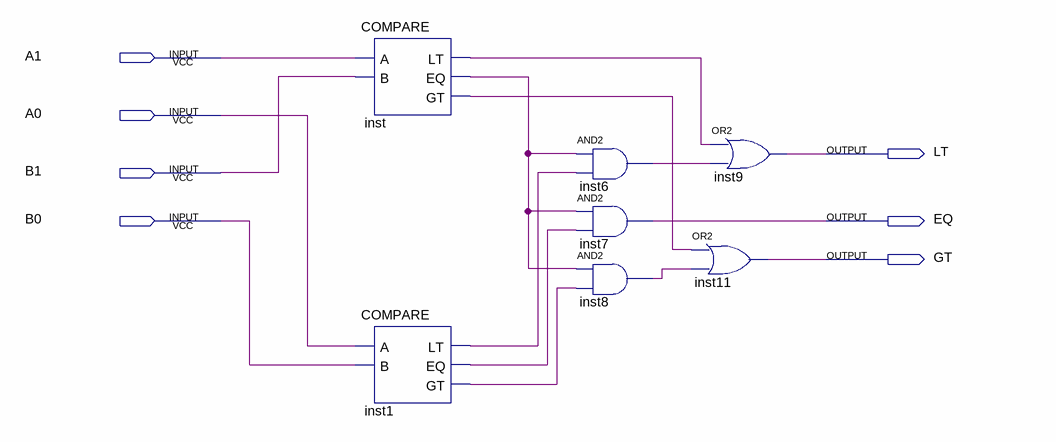
[diagram p0: schematic sheet]
// Quartus schematic COMPARE_2Bit.bdf as structural Verilog: 7 symbols, 7 pins
module COMPARE_2Bit (
  input  A1,
  input  A0,
  input  B1,
  input  B0,
  output LT,
  output EQ,
  output GT
);

  wire inst1_eq, inst1_gt, inst1_lt, inst6_out, inst8_out, inst_eq, inst_gt, inst_lt;

  COMPARE inst (.A(A1), .B(B1), .LT(inst_lt), .EQ(inst_eq), .GT(inst_gt));
  COMPARE inst1 (.A(A0), .B(B0), .LT(inst1_lt), .EQ(inst1_eq), .GT(inst1_gt));
  and inst6 (inst6_out, inst_eq, inst1_lt);
  and inst7 (EQ, inst_eq, inst1_eq);
  and inst8 (inst8_out, inst_eq, inst1_gt);
  or inst9 (LT, inst_lt, inst6_out);
  or inst11 (GT, inst_gt, inst8_out);
endmodule
